# EAGLE design SensorHub (EAGLE 9.5.2)
CNAME: https://github.com/thomo/sensornode; CREVISION: v2.0; DESIGNER: ThoMo
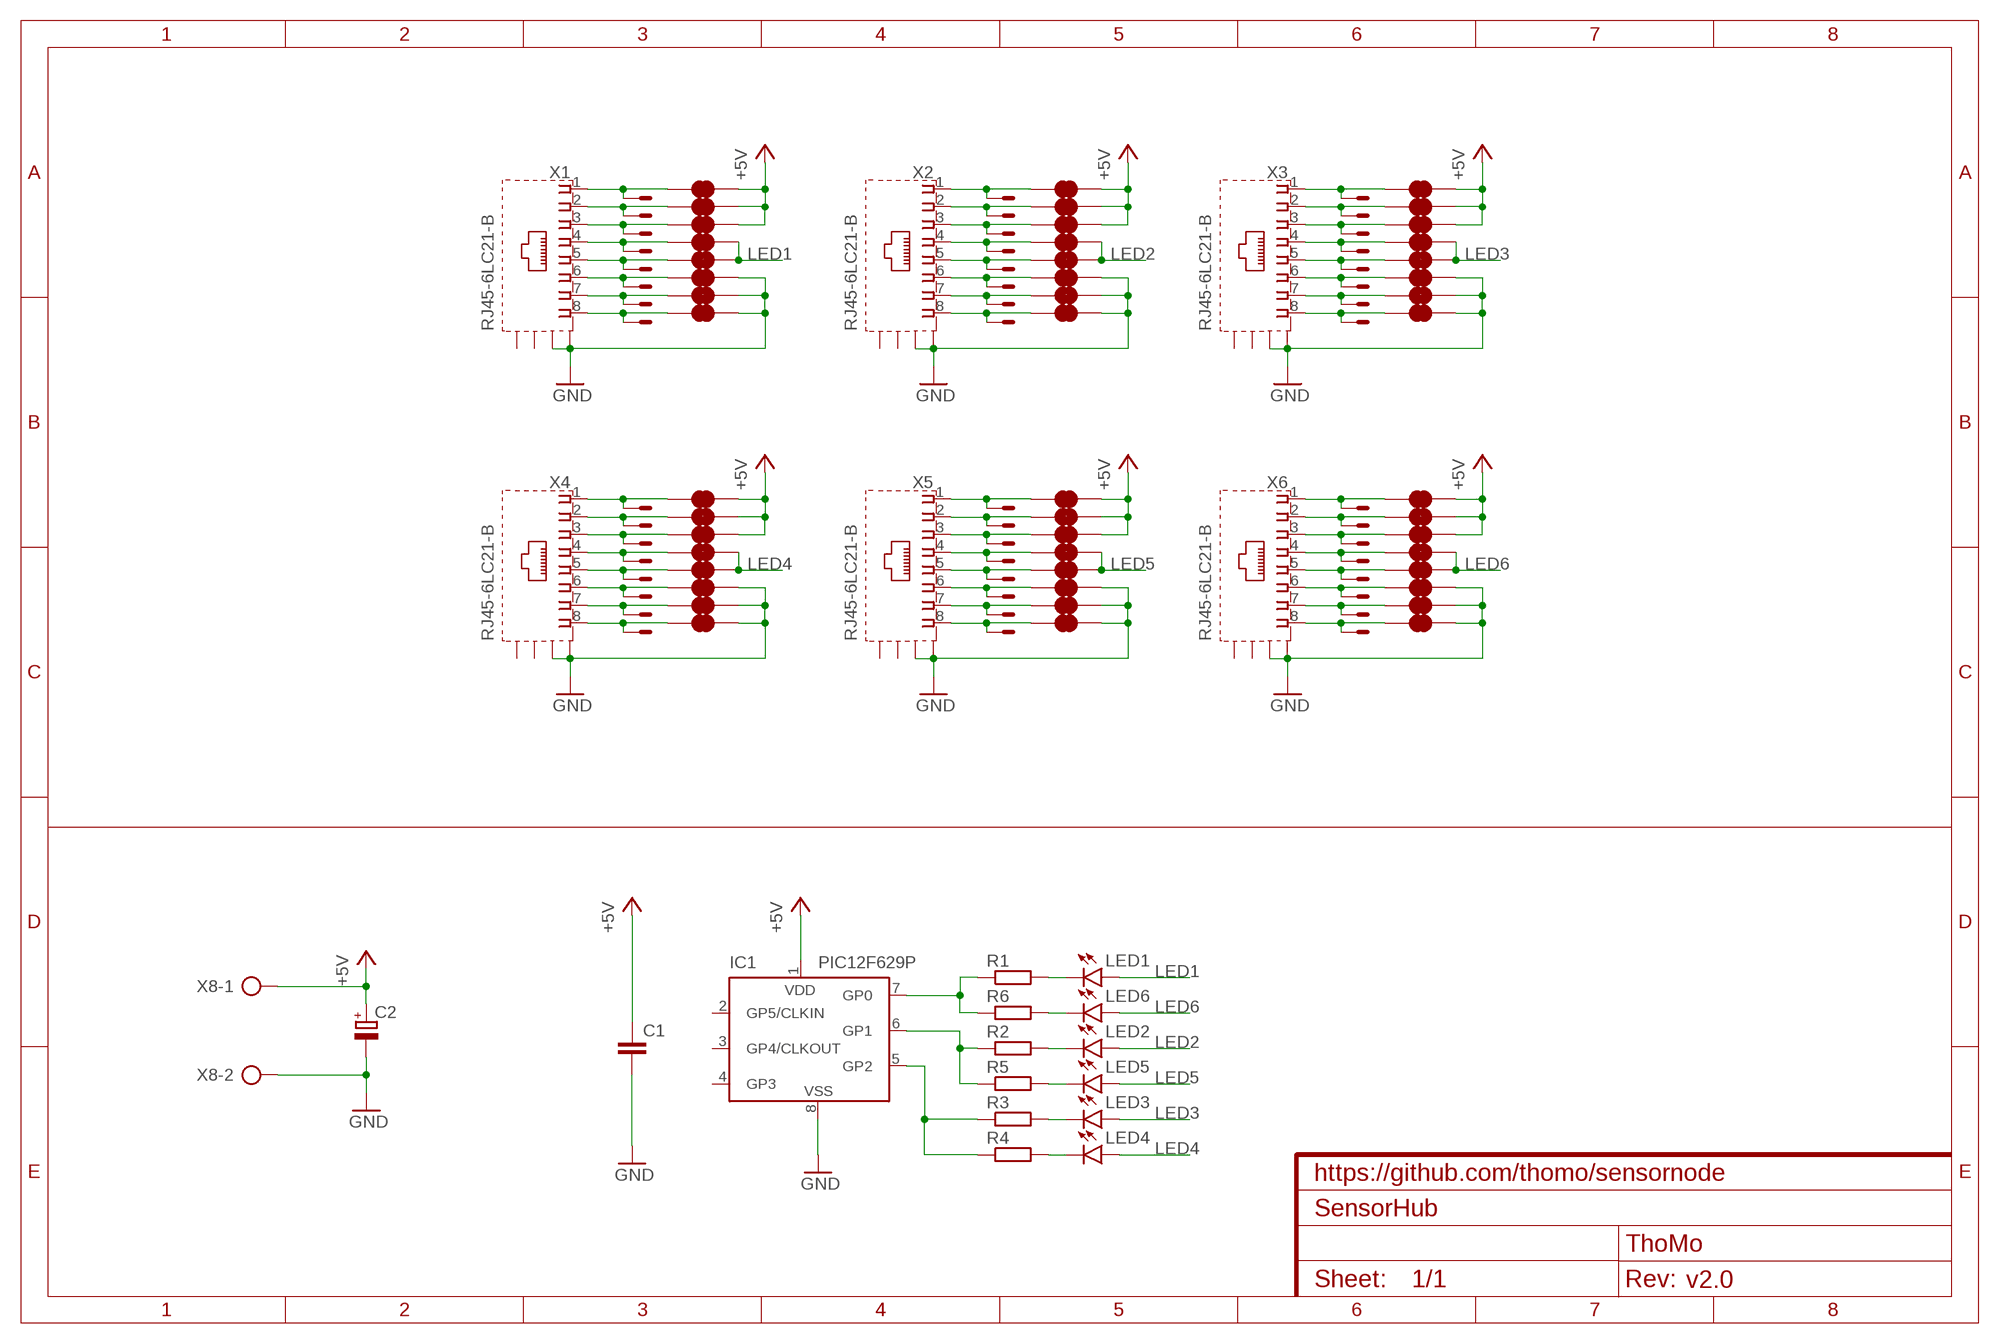
[diagram p0: schematic, sheet 1]

## Parts
C1  C-EU050-024X044  [C050-024X044]
C2  CPOL-EUE3.5-8  [E3,5-8]
IC1  PIC12F629P  [DIL8]
JP1  JUMPER-SMT_2_NC_TRACE_SILK  [SMT-JUMPER_2_NC_TRACE_SILK]
JP2  JUMPER-SMT_2_NC_TRACE_SILK  [SMT-JUMPER_2_NC_TRACE_SILK]
JP3  JUMPER-SMT_2_NC_TRACE_SILK  [SMT-JUMPER_2_NC_TRACE_SILK]
JP4  JUMPER-SMT_2_NC_TRACE_SILK  [SMT-JUMPER_2_NC_TRACE_SILK]
JP5  JUMPER-SMT_2_NC_TRACE_SILK  [SMT-JUMPER_2_NC_TRACE_SILK]
JP6  JUMPER-SMT_2_NC_TRACE_SILK  [SMT-JUMPER_2_NC_TRACE_SILK]
JP7  JUMPER-SMT_2_NC_TRACE_SILK  [SMT-JUMPER_2_NC_TRACE_SILK]
JP8  JUMPER-SMT_2_NC_TRACE_SILK  [SMT-JUMPER_2_NC_TRACE_SILK]
JP9  JUMPER-SMT_2_NC_TRACE_SILK  [SMT-JUMPER_2_NC_TRACE_SILK]
JP10  JUMPER-SMT_2_NC_TRACE_SILK  [SMT-JUMPER_2_NC_TRACE_SILK]
JP11  JUMPER-SMT_2_NC_TRACE_SILK  [SMT-JUMPER_2_NC_TRACE_SILK]
JP12  JUMPER-SMT_2_NC_TRACE_SILK  [SMT-JUMPER_2_NC_TRACE_SILK]
JP13  JUMPER-SMT_2_NC_TRACE_SILK  [SMT-JUMPER_2_NC_TRACE_SILK]
JP14  JUMPER-SMT_2_NC_TRACE_SILK  [SMT-JUMPER_2_NC_TRACE_SILK]
JP15  JUMPER-SMT_2_NC_TRACE_SILK  [SMT-JUMPER_2_NC_TRACE_SILK]
JP16  JUMPER-SMT_2_NC_TRACE_SILK  [SMT-JUMPER_2_NC_TRACE_SILK]
JP17  JUMPER-SMT_2_NC_TRACE_SILK  [SMT-JUMPER_2_NC_TRACE_SILK]
JP18  JUMPER-SMT_2_NC_TRACE_SILK  [SMT-JUMPER_2_NC_TRACE_SILK]
JP19  JUMPER-SMT_2_NC_TRACE_SILK  [SMT-JUMPER_2_NC_TRACE_SILK]
JP20  JUMPER-SMT_2_NC_TRACE_SILK  [SMT-JUMPER_2_NC_TRACE_SILK]
JP21  JUMPER-SMT_2_NC_TRACE_SILK  [SMT-JUMPER_2_NC_TRACE_SILK]
JP22  JUMPER-SMT_2_NC_TRACE_SILK  [SMT-JUMPER_2_NC_TRACE_SILK]
JP23  JUMPER-SMT_2_NC_TRACE_SILK  [SMT-JUMPER_2_NC_TRACE_SILK]
JP24  JUMPER-SMT_2_NC_TRACE_SILK  [SMT-JUMPER_2_NC_TRACE_SILK]
JP25  JUMPER-SMT_2_NC_TRACE_SILK  [SMT-JUMPER_2_NC_TRACE_SILK]
JP26  JUMPER-SMT_2_NC_TRACE_SILK  [SMT-JUMPER_2_NC_TRACE_SILK]
JP27  JUMPER-SMT_2_NC_TRACE_SILK  [SMT-JUMPER_2_NC_TRACE_SILK]
JP28  JUMPER-SMT_2_NC_TRACE_SILK  [SMT-JUMPER_2_NC_TRACE_SILK]
JP29  JUMPER-SMT_2_NC_TRACE_SILK  [SMT-JUMPER_2_NC_TRACE_SILK]
JP30  JUMPER-SMT_2_NC_TRACE_SILK  [SMT-JUMPER_2_NC_TRACE_SILK]
JP31  JUMPER-SMT_2_NC_TRACE_SILK  [SMT-JUMPER_2_NC_TRACE_SILK]
JP32  JUMPER-SMT_2_NC_TRACE_SILK  [SMT-JUMPER_2_NC_TRACE_SILK]
JP33  JUMPER-SMT_2_NC_TRACE_SILK  [SMT-JUMPER_2_NC_TRACE_SILK]
JP34  JUMPER-SMT_2_NC_TRACE_SILK  [SMT-JUMPER_2_NC_TRACE_SILK]
JP35  JUMPER-SMT_2_NC_TRACE_SILK  [SMT-JUMPER_2_NC_TRACE_SILK]
JP36  JUMPER-SMT_2_NC_TRACE_SILK  [SMT-JUMPER_2_NC_TRACE_SILK]
JP37  JUMPER-SMT_2_NC_TRACE_SILK  [SMT-JUMPER_2_NC_TRACE_SILK]
JP38  JUMPER-SMT_2_NC_TRACE_SILK  [SMT-JUMPER_2_NC_TRACE_SILK]
JP39  JUMPER-SMT_2_NC_TRACE_SILK  [SMT-JUMPER_2_NC_TRACE_SILK]
JP40  JUMPER-SMT_2_NC_TRACE_SILK  [SMT-JUMPER_2_NC_TRACE_SILK]
JP41  JUMPER-SMT_2_NC_TRACE_SILK  [SMT-JUMPER_2_NC_TRACE_SILK]
JP42  JUMPER-SMT_2_NC_TRACE_SILK  [SMT-JUMPER_2_NC_TRACE_SILK]
JP43  JUMPER-SMT_2_NC_TRACE_SILK  [SMT-JUMPER_2_NC_TRACE_SILK]
JP44  JUMPER-SMT_2_NC_TRACE_SILK  [SMT-JUMPER_2_NC_TRACE_SILK]
JP45  JUMPER-SMT_2_NC_TRACE_SILK  [SMT-JUMPER_2_NC_TRACE_SILK]
JP46  JUMPER-SMT_2_NC_TRACE_SILK  [SMT-JUMPER_2_NC_TRACE_SILK]
JP47  JUMPER-SMT_2_NC_TRACE_SILK  [SMT-JUMPER_2_NC_TRACE_SILK]
JP48  JUMPER-SMT_2_NC_TRACE_SILK  [SMT-JUMPER_2_NC_TRACE_SILK]
LED1  TLLR4400  [LED3MM]
LED2  TLLR4400  [LED3MM]
LED3  TLLR4400  [LED3MM]
LED4  TLLR4400  [LED3MM]
LED5  TLLR4400  [LED3MM]
LED6  TLLR4400  [LED3MM]
R1  R-EU_0207/10  [0207/10]
R2  R-EU_0207/10  [0207/10]
R3  R-EU_0207/10  [0207/10]
R4  R-EU_0207/10  [0207/10]
R5  R-EU_0207/10  [0207/10]
R6  R-EU_0207/10  [0207/10]
X1  RJ45-6LC21-B  [RJ45-SHIELD1]
X1.1  22-23-2081  [22-23-2081]
X1.2  22-23-2081  [22-23-2081]
X1.3  22-23-2081  [22-23-2081]
X1.4  22-23-2081  [22-23-2081]
X1.5  22-23-2081  [22-23-2081]
X1.6  22-23-2081  [22-23-2081]
X2  RJ45-6LC21-B  [RJ45-SHIELD1]
X3  RJ45-6LC21-B  [RJ45-SHIELD1]
X4  RJ45-6LC21-B  [RJ45-SHIELD1]
X5  RJ45-6LC21-B  [RJ45-SHIELD1]
X6  RJ45-6LC21-B  [RJ45-SHIELD1]
X8  AK500/2  [AK500/2]

## Nets
+5V: C1.1 C2.+ IC1.1(VDD) JP1.2 JP2.2 JP3.2 JP9.2 JP10.2 JP11.2 JP17.2 JP18.2 JP19.2 JP25.2 JP26.2 JP27.2 JP33.2 JP34.2 JP35.2 JP41.2 JP42.2 JP43.2 X8.1
GND: C1.2 C2.- IC1.8(VSS) JP6.2 JP7.2 JP8.2 JP14.2 JP15.2 JP16.2 JP22.2 JP23.2 JP24.2 JP30.2 JP31.2 JP32.2 JP38.2 JP39.2 JP40.2 JP46.2 JP47.2 JP48.2 X1.S1(S) X1.S2(S) X2.S1(S) X2.S2(S) X3.S1(S) X3.S2(S) X4.S1(S) X4.S2(S) X5.S1(S) X5.S2(S) X6.S1(S) X6.S2(S) X8.2
LED1: JP4.2 JP5.2 LED1.A
LED2: JP12.2 JP13.2 LED2.A
LED3: JP20.2 JP21.2 LED3.A
LED4: JP28.2 JP29.2 LED4.A
LED5: JP36.2 JP37.2 LED5.A
LED6: JP44.2 JP45.2 LED6.A
N$1: JP1.1 X1.1 X1.1.1
N$2: JP2.1 X1.1.2 X1.2
N$3: JP3.1 X1.1.3 X1.3
N$4: JP4.1 X1.1.4 X1.4
N$5: JP5.1 X1.1.5 X1.5
N$6: JP6.1 X1.1.6 X1.6
N$7: JP7.1 X1.1.7 X1.7
N$8: JP8.1 X1.1.8 X1.8
N$9: JP9.1 X1.2.1 X2.1
N$10: IC1.6(GP1) R2.1 R5.1
N$11: LED1.K(C) R1.2
N$12: LED2.K(C) R2.2
N$13: LED3.K(C) R3.2
N$14: LED6.K(C) R6.2
N$15: LED5.K(C) R5.2
N$16: LED4.K(C) R4.2
N$17: JP10.1 X1.2.2 X2.2
N$18: JP11.1 X1.2.3 X2.3
N$19: JP12.1 X1.2.4 X2.4
N$20: IC1.7(GP0) R1.1 R6.1
N$21: JP13.1 X1.2.5 X2.5
N$22: IC1.5(GP2) R3.1 R4.1
N$23: JP14.1 X1.2.6 X2.6
N$24: JP15.1 X1.2.7 X2.7
N$25: JP16.1 X1.2.8 X2.8
N$26: JP17.1 X1.3.1 X3.1
N$27: JP18.1 X1.3.2 X3.2
N$28: JP19.1 X1.3.3 X3.3
N$29: JP20.1 X1.3.4 X3.4
N$30: JP21.1 X1.3.5 X3.5
N$31: JP22.1 X1.3.6 X3.6
N$32: JP23.1 X1.3.7 X3.7
N$33: JP24.1 X1.3.8 X3.8
N$34: JP25.1 X1.4.1 X4.1
N$35: JP26.1 X1.4.2 X4.2
N$36: JP27.1 X1.4.3 X4.3
N$37: JP28.1 X1.4.4 X4.4
N$38: JP29.1 X1.4.5 X4.5
N$39: JP30.1 X1.4.6 X4.6
N$40: JP31.1 X1.4.7 X4.7
N$41: JP32.1 X1.4.8 X4.8
N$42: JP33.1 X1.5.1 X5.1
N$43: JP34.1 X1.5.2 X5.2
N$44: JP35.1 X1.5.3 X5.3
N$45: JP36.1 X1.5.4 X5.4
N$46: JP37.1 X1.5.5 X5.5
N$47: JP38.1 X1.5.6 X5.6
N$48: JP39.1 X1.5.7 X5.7
N$49: JP40.1 X1.5.8 X5.8
N$50: JP41.1 X1.6.1 X6.1
N$51: JP42.1 X1.6.2 X6.2
N$52: JP43.1 X1.6.3 X6.3
N$53: JP44.1 X1.6.4 X6.4
N$54: JP45.1 X1.6.5 X6.5
N$55: JP46.1 X1.6.6 X6.6
N$56: JP47.1 X1.6.7 X6.7
N$57: JP48.1 X1.6.8 X6.8
Unconnected: IC1.2(GP5/CLKIN) IC1.3(GP4/CLKOUT) IC1.4(GP3) X1.S3(S) X1.S4(S) X2.S3(S) X2.S4(S) X3.S3(S) X3.S4(S) X4.S3(S) X4.S4(S) X5.S3(S) X5.S4(S) X6.S3(S) X6.S4(S)

## Library data of the parts
C1 = rcl:C-EU: CAPACITOR, European symbol; SPICEPREFIX: C
C2 = rcl:CPOL-EU: POLARIZED CAPACITOR, European symbol; SPICEPREFIX: C
IC1 = microchip:PIC12F6*: Data Sheet 8-Pin FLASH-Based 8-Bit CMOS Microcontrollers Source: http://www.microchip.com .. 41190c.pdf; MF: MICROCHIP; MPN: PIC12F629-I/P; OC_FARNELL: 1292253; OC_NEWARK: 67K0822
JP1-JP48 = SparkFun-Jumpers:JUMPER-SMT_2_NC_TRACE: Normally closed trace jumper This jumper has a trace between two pads so it's normally closed (NC). Use a razor knife to open the connection. For best results follow the IPC guidelines for cutting traces: Cutout at least 0.063 mm (0.005 in). Remove all loose material to clean up the cut area. Seal the cut with an approved epoxy. Reapply solder to reclose the connection.
LED1-LED6 = led:TLLR4400: Low Current (2mA) LED 3 mm Tinted Diffused Package color RED Source: Data sheet <http://www.farnell.com/datasheets/391100.pdf>; MF: VISHAY SEMICONDUCTOR; OC_FARNELL: 1612437
R1-R6 = rcl:R-EU_: RESISTOR, European symbol; SPICEPREFIX: R
X1-X6 = con-tycoelectronics:RJ45*2: RJ45 Low Profile Shield Type 2 For all RJ45 L, LC, LCT and X Series Models Source: www.tycoelectronics.com .. ENG_DS_1654001_1099_RJ_L_0507.pdf; OC_FARNELL: unknown; OC_NEWARK: unknown
X1.1-X1.6 = con-molex:22-23-2081: .100" (2.54mm) Center Header - 8 Pin; MF: MOLEX; MPN: 22-23-2081; OC_FARNELL: 1756826; OC_NEWARK: 01C7592
X8 = con-ptr500:AK500/2: CONNECTOR; OC_FARNELL: unknown; OC_NEWARK: unknown

## Board
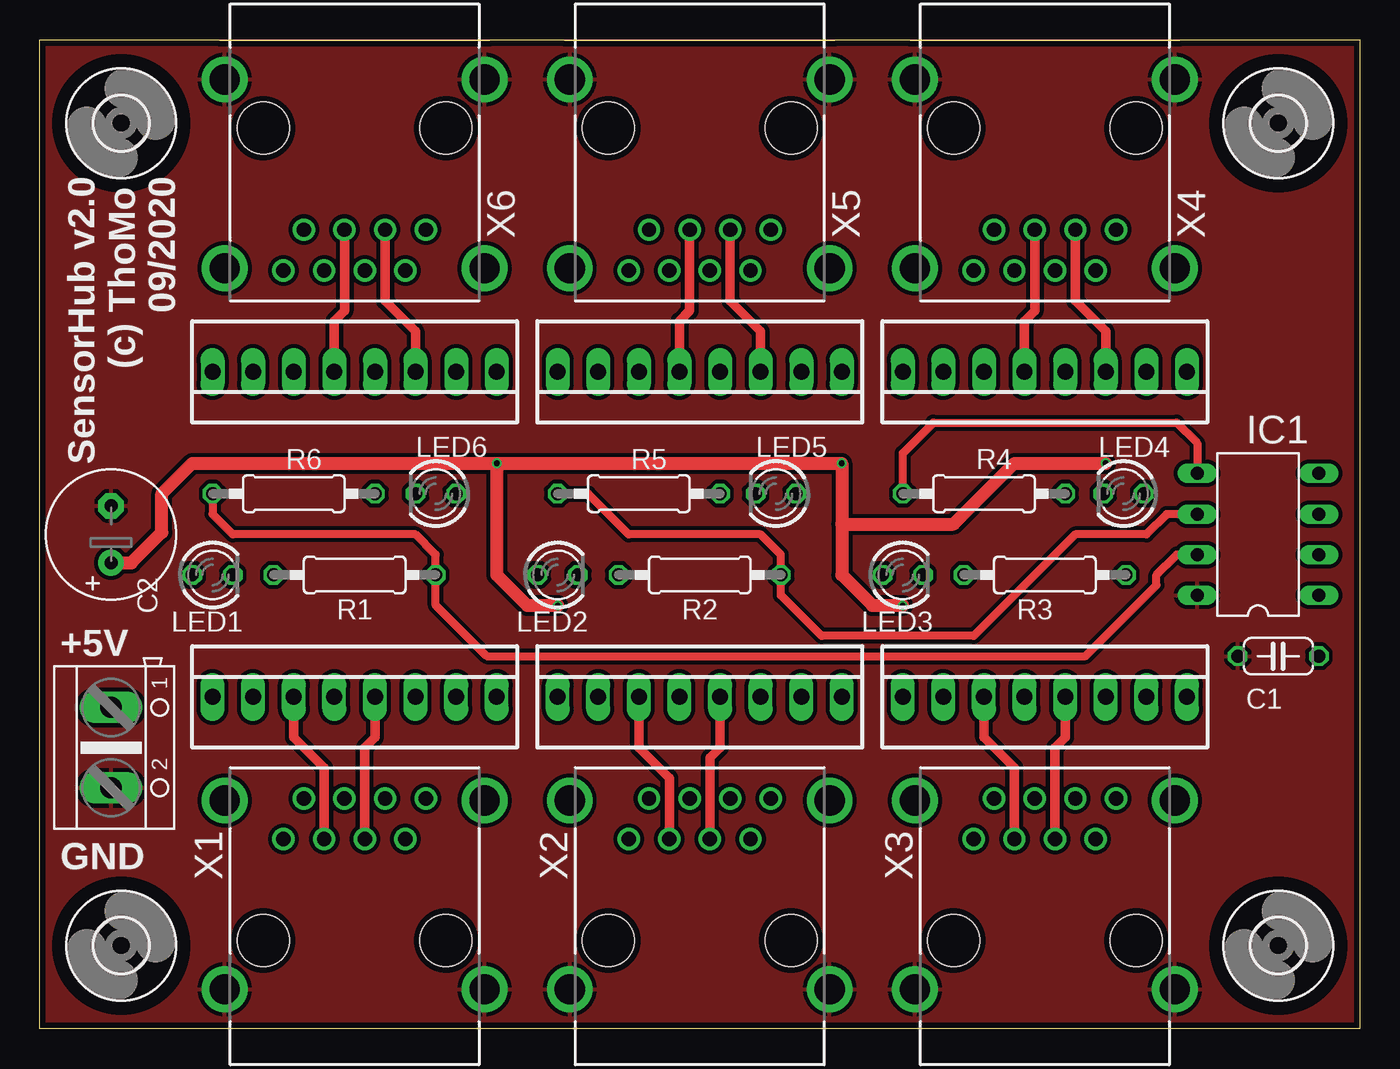
[diagram p1: board, top side]
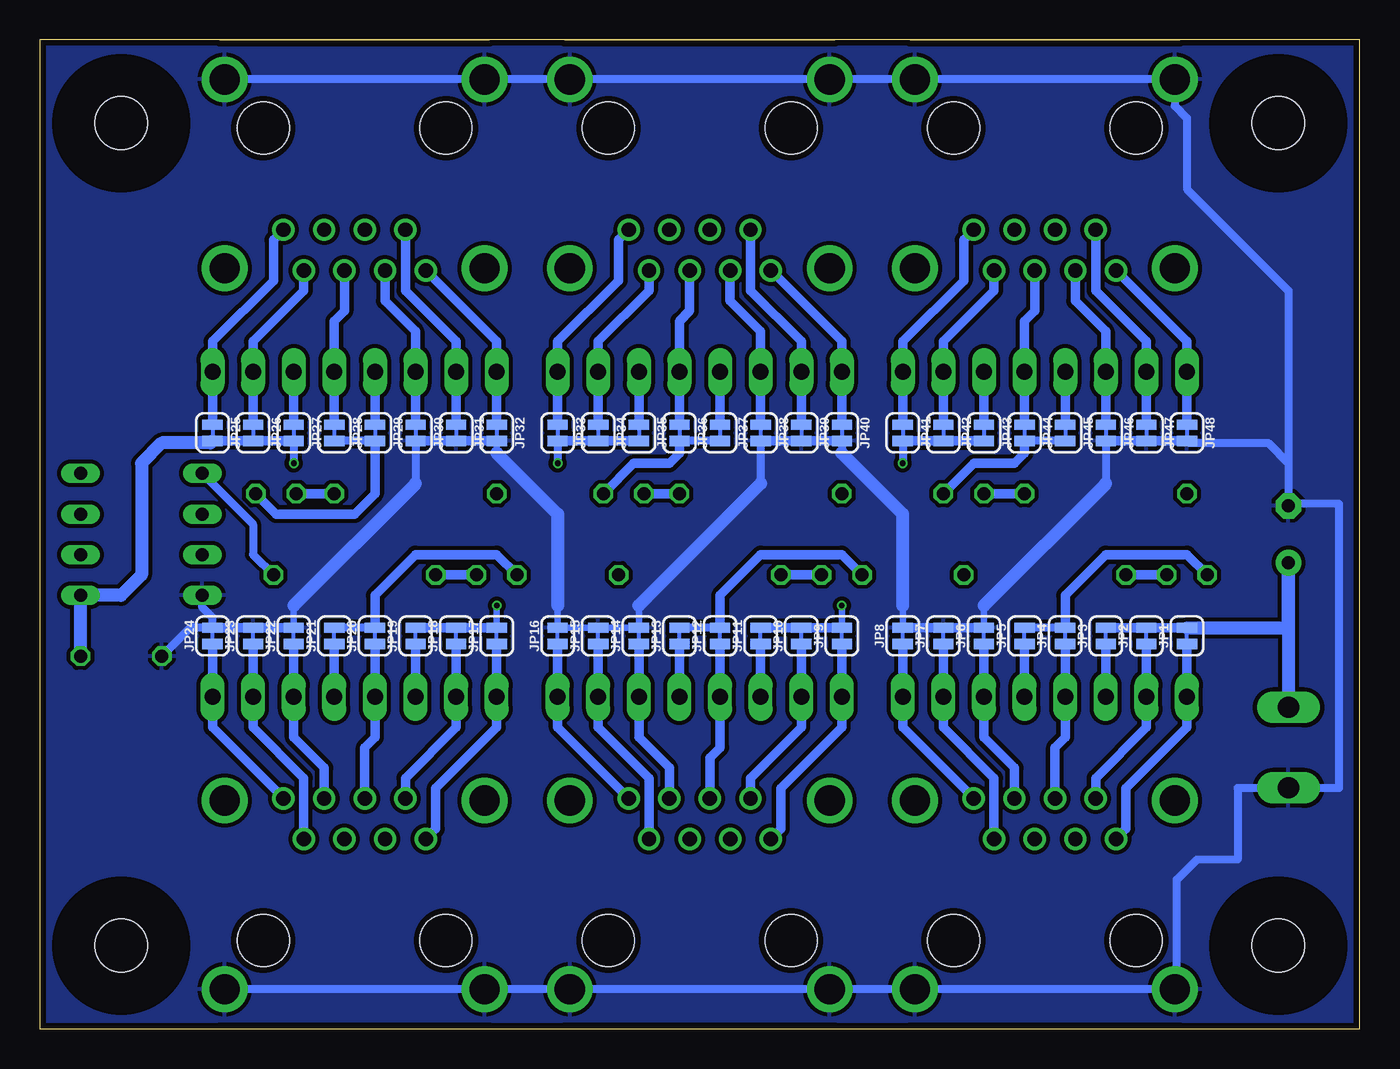
[diagram p2: board, bottom side, seen from below]

Size 82.55 x 61.83 mm. Coordinates in mm from the lower left corner, seen from the top.
Outline: 0,0 0,61.83 82.55,61.83 82.55,0 0,0
Copper layers (1*16): Top 0.035559375mm / dielectric 1.6mm / Bottom 0.035559375mm
Design rules "oshpark-2layer": minimum track width 6mil, minimum drill 10mil, track to track 6mil, track to pad 6mil, pad to pad 6mil, via to via 6mil, smd to smd 6mil, copper to edge 15mil, drill to drill 6mil, minimum pad ring 5mil, minimum via ring 5mil, stop-mask expansion 2.5mil, vias tented up to drill 0mil, thermal gap 10mil

### Footprints (pad centres in the part's own frame; a part is rotated, then mirrored left to right if it is on the bottom)
C050-024X044 = drill 0.813 octagon: 1 -2.54,0; 2 2.54,0
E3,5-8 = drill 0.813 pad 1.6: + -1.778,0 | drill 0.813 pad 1.6 octagon: - 1.778,0
DIL8 = drill 0.813 long: 1 -3.81,-3.81; 2 -1.27,-3.81; 3 1.27,-3.81; 4 3.81,-3.81; 5 3.81,3.81; 6 1.27,3.81; 7 -1.27,3.81; 8 -3.81,3.81
SMT-JUMPER_2_NC_TRACE_SILK = smd 0.635 x 1.27: 1 -0.508,0; 2 0.508,0
LED3MM = drill 0.813 octagon: A -1.27,0; K 1.27,0
0207/10 = drill 0.813 octagon: 1 -5.08,0; 2 5.08,0
3,3 = hole 3.3: 0,0
RJ45-SHIELD1 = drill 0.9 pad 1.4: 1 -4.445,6.35; 2 -3.175,8.89; 3 -1.905,6.35; 4 -0.635,8.89; 5 0.635,6.35; 6 1.905,8.89; 7 3.175,6.35; 8 4.445,8.89 | drill 1.9 pad 2.5: S1 -8.128,-3.048; S2 8.128,-3.048; S3 -8.128,8.76; S4 8.128,8.76 | hole 3.251: -5.715,0; 5.715,0
22-23-2081 = drill 1 long: 1 -8.89,0; 2 -6.35,0; 3 -3.81,0; 4 -1.27,0; 5 1.27,0; 6 3.81,0; 7 6.35,0; 8 8.89,0
AK500/2 = drill 1.321 long: 1 -2.515,0; 2 2.515,0

### Placement (x,y rotation side)
C1  77.47,23.3 180 top
C2  4.45,30.92 90 top
IC1  76.2,30.92 90 top
JP1  10.79,24.57 90 bottom
JP2  13.34,24.57 90 bottom
JP3  15.88,24.57 90 bottom
JP4  18.41,24.57 90 bottom
JP5  20.95,24.57 90 bottom
JP6  23.5,24.57 90 bottom
JP7  26.04,24.57 90 bottom
JP8  28.57,24.57 90 bottom
JP9  32.38,24.57 90 bottom
JP10  34.92,24.57 90 bottom
JP11  37.47,24.57 90 bottom
JP12  40.01,24.57 90 bottom
JP13  42.55,24.57 90 bottom
JP14  45.09,24.57 90 bottom
JP15  47.62,24.57 90 bottom
JP16  50.16,24.57 90 bottom
JP17  53.98,24.57 90 bottom
JP18  56.52,24.57 90 bottom
JP19  59.05,24.57 90 bottom
JP20  61.59,24.57 90 bottom
JP21  64.14,24.57 90 bottom
JP22  66.67,24.57 90 bottom
JP23  69.22,24.57 90 bottom
JP24  71.75,24.57 90 bottom
JP25  71.75,37.27 270 bottom
JP26  69.22,37.27 270 bottom
JP27  66.67,37.27 270 bottom
JP28  64.14,37.27 270 bottom
JP29  61.59,37.27 270 bottom
JP30  59.05,37.27 270 bottom
JP31  56.52,37.27 270 bottom
JP32  53.98,37.27 270 bottom
JP33  50.16,37.27 270 bottom
JP34  47.62,37.27 270 bottom
JP35  45.09,37.27 270 bottom
JP36  42.55,37.27 270 bottom
JP37  40.01,37.27 270 bottom
JP38  37.47,37.27 270 bottom
JP39  34.92,37.27 270 bottom
JP40  32.38,37.27 270 bottom
JP41  28.57,37.27 270 bottom
JP42  26.04,37.27 270 bottom
JP43  23.5,37.27 270 bottom
JP44  20.95,37.27 270 bottom
JP45  18.41,37.27 270 bottom
JP46  15.88,37.27 270 bottom
JP47  13.34,37.27 270 bottom
JP48  10.79,37.27 270 bottom
LED1  10.79,28.38 0 top
LED2  32.38,28.38 0 top
LED3  53.98,28.38 0 top
LED4  67.79,33.46 180 top
LED5  46.04,33.46 180 top
LED6  24.77,33.46 180 top
R1  19.68,28.38 180 top
R2  41.27,28.38 180 top
R3  62.87,28.38 180 top
R4  59.05,33.46 0 top
R5  37.47,33.46 0 top
R6  15.88,33.46 0 top
U$1  [3,3]  5.08,5.2 0 top
U$2  [3,3]  5.08,56.63 0 top
U$3  [3,3]  77.47,56.63 0 top
U$4  [3,3]  77.47,5.2 0 top
X1  19.68,5.52 0 top
X1.1  19.68,20.76 0 top
X1.2  41.27,20.76 0 top
X1.3  62.87,20.76 0 top
X1.4  62.87,41.08 180 top
X1.5  41.27,41.08 180 top
X1.6  19.68,41.08 180 top
X2  41.27,5.52 0 top
X3  62.87,5.52 0 top
X4  62.87,56.32 180 top
X5  41.27,56.32 180 top
X6  19.68,56.32 180 top
X8  4.45,17.58 270 top

### Tracks (layer width: path | path; a pad name or v marks a point on that pad's centre or on a via)
+5V  (via drill 0.35)
  Top 0.813: v28.57,35.36 28.57,28.38 30.48,26.47 v32.38,26.47 | 50.16,31.55 v50.16,35.36 v28.57,35.36 | 50.16,31.55 50.16,28.38 52.07,26.47 v53.98,26.47 | C2.+ 5.71,29.14 7.62,31.04 7.62,33.46 9.53,35.36 v28.57,35.36 | 50.16,31.55 57.15,31.55 60.96,35.36 v66.67,35.36
  Bottom 0.406: JP9.2 v32.38,26.47 | JP17.2 v53.98,26.47
  Bottom 0.508: JP41.2 v28.57,35.36 | JP33.2 v50.16,35.36 | JP27.2 v66.67,35.36
  Bottom 0.61: JP19.2 JP18.2 JP17.2 | JP11.2 JP10.2 JP9.2 | JP3.2 JP2.2 JP1.2 | JP27.2 JP26.2 JP25.2 | JP35.2 JP34.2 JP33.2 | JP41.2 JP42.2 JP43.2
  Bottom 0.813: X8.1 C2.+ 4.45,25.07 JP1.2 | C1.1 IC1.1 77.47,27.11 76.2,28.38 76.2,35.36 74.93,36.63 71.88,36.63 JP25.2
GND
  Bottom 0.406: 66.67,26.47 JP22.2 | JP32.2 53.98,36 | 50.16,26.47 JP16.2 JP15.2 JP14.2 45.09,26.47 | JP8.2 28.57,26.47 | JP6.2 23.5,26.47
  Bottom 0.508: JP30.2 59.05,34.09 | JP38.2 37.47,34.09 | JP40.2 32.38,36 | JP46.2 15.88,34.09 | IC1.8 72.39,26.34 71.75,25.71 JP24.2 73.15,25.07 C1.2 | JP48.2 10.67,36.63 5.71,36.63 4.45,35.36 | 4.45,35.36 4.45,32.82 | 4.45,32.82 C2.- | 4.45,32.82 1.27,32.82 1.27,15.07 X8.2 4.47,15.04 7.62,15.04 7.62,10.6 10.16,10.6 11.43,9.33 11.43,2.6 X1.S1 X1.S2 X2.S1 X2.S2 X3.S1 X3.S2 | X4.S1 X4.S2 X5.S1 X5.S2 X6.S1 X6.S2 11.56,57.71 10.79,56.95 10.79,52.51 4.45,46.16 4.45,35.36
  Bottom 0.61: JP22.2 JP23.2 JP24.2 | JP6.2 JP7.2 JP8.2 | JP32.2 JP31.2 JP30.2 | JP40.2 JP39.2 JP38.2 | JP46.2 JP47.2 JP48.2
  Bottom 0.813: 59.05,34.09 66.67,26.47 | 53.98,36 50.16,32.19 50.16,26.47 | 37.47,34.09 45.09,26.47 | 32.38,36 28.57,32.19 28.57,26.47 | 15.88,34.09 23.5,26.47
  pour Bottom (isolate 0.254): 0,61.71 0,0.12 82.55,0.12 82.55,61.71
  pour Top (isolate 0.254): 0,61.71 0,0.12 82.55,0.12 82.55,61.71
LED1
  Bottom 0.508: JP4.2 JP5.2
  Bottom 0.61: JP4.2 18.41,27.11 15.88,29.65 10.79,29.65 LED1.A
LED2
  Bottom 0.508: JP12.2 JP13.2
  Bottom 0.61: JP12.2 40.01,27.11 37.47,29.65 32.38,29.65 LED2.A
LED3
  Bottom 0.508: JP20.2 JP21.2
  Bottom 0.61: JP20.2 61.59,27.11 59.05,29.65 53.98,29.65 LED3.A
LED4
  Bottom 0.508: JP29.2 JP28.2
  Bottom 0.61: JP29.2 61.59,33.46 62.87,32.19 67.79,32.19 LED4.A
LED5
  Bottom 0.508: JP37.2 JP36.2
  Bottom 0.61: LED5.A 45.4,35.36 43.18,35.36 42.55,36 JP36.2
LED6
  Bottom 0.508: JP45.2 JP44.2
  Bottom 0.61: JP44.2 20.95,36 21.59,35.36 24.13,35.36 LED6.A
N$1
  Bottom 0.61: X1.1 14.61,12.5 14.61,15.04 10.79,18.85 X1.1.1 JP1.1
N$2
  Bottom 0.61: X1.2 16.51,15.68 13.34,18.85 X1.1.2 JP2.1
N$3
  Top 0.61: X1.1.3 15.88,18.22 17.78,16.31 X1.3
  Bottom 0.61: JP3.1 X1.1.3
N$4
  Bottom 0.61: X1.4 19.05,17.58 18.41,18.22 X1.1.4 JP4.1
N$5
  Top 0.61: X1.1.5 20.95,18.22 20.32,17.58 X1.5
  Bottom 0.61: JP5.1 X1.1.5
N$6
  Bottom 0.61: X1.6 21.59,16.31 23.5,18.22 X1.1.6 JP6.1
N$7
  Bottom 0.61: X1.7 22.86,15.68 26.04,18.85 X1.1.7 JP7.1
N$8
  Bottom 0.61: X1.8 28.57,18.85 X1.1.8 JP8.1
N$9
  Bottom 0.61: X2.1 36.2,12.5 36.2,15.04 32.38,18.85 X1.2.1 JP9.1
N$10
  Top 0.508: R5.1 34.29,33.46 36.83,30.92 45.09,30.92 46.35,29.65 R2.1 46.35,27.11 48.9,24.57 58.42,24.57 64.77,30.92 69.22,30.92 70.48,32.19 IC1.6
N$11
  Bottom 0.61: LED1.K R1.2
N$12
  Bottom 0.61: LED2.K R2.2
N$13
  Bottom 0.61: LED3.K R3.2
N$14
  Bottom 0.61: R6.2 LED6.K
N$15
  Bottom 0.61: R5.2 LED5.K
N$16
  Bottom 0.61: R4.2 LED4.K
N$17
  Bottom 0.61: X2.2 38.1,15.68 34.92,18.85 X1.2.2 JP10.1
N$18
  Top 0.61: X2.3 39.37,15.68 37.47,17.58 X1.2.3
  Bottom 0.61: JP11.1 X1.2.3
N$19
  Bottom 0.61: X2.4 40.64,16.95 40.01,17.58 X1.2.4 JP12.1
N$20
  Top 0.508: R6.1 10.79,32.19 12.06,30.92 23.5,30.92 24.77,29.65 R1.1 24.77,26.47 27.94,23.3 65.41,23.3 69.85,27.74 69.85,28.38 71.12,29.65 IC1.7
N$21
  Top 0.61: X2.5 41.91,16.95 42.55,17.58 X1.2.5
  Bottom 0.61: JP13.1 X1.2.5
N$22
  Top 0.508: IC1.5 72.39,36.63 71.12,37.9 55.88,37.9 53.98,36 R4.1
  Bottom 0.508: IC1.5 69.22,31.55 69.22,29.65 R3.1
N$23
  Bottom 0.61: X2.6 43.18,16.31 45.09,18.22 X1.2.6 JP14.1
N$24
  Bottom 0.61: X2.7 44.45,15.68 47.62,18.85 X1.2.7 JP15.1
N$25
  Bottom 0.61: X2.8 50.16,18.85 X1.2.8 JP16.1
N$26
  Bottom 0.61: X3.1 57.78,12.5 57.78,15.04 53.98,18.85 X1.3.1 JP17.1
N$27
  Bottom 0.61: X3.2 59.69,15.68 56.52,18.85 X1.3.2 JP18.1
N$28
  Top 0.61: X3.3 60.96,16.31 59.05,18.22 X1.3.3
  Bottom 0.61: JP19.1 X1.3.3
N$29
  Bottom 0.61: X3.4 62.23,17.58 61.59,18.22 X1.3.4 JP20.1
N$30
  Top 0.61: X3.5 63.5,17.58 64.14,18.22 X1.3.5
  Bottom 0.61: JP21.1 X1.3.5
N$31
  Bottom 0.61: X3.6 64.77,16.31 66.67,18.22 X1.3.6 JP22.1
N$32
  Bottom 0.61: X3.7 66.04,15.68 69.22,18.85 X1.3.7 JP23.1
N$33
  Bottom 0.61: X3.8 71.75,18.85 X1.3.8 JP24.1
N$34
  Bottom 0.61: X4.1 67.94,49.33 67.94,46.79 71.75,42.98 X1.4.1 JP25.1
N$35
  Bottom 0.61: X4.2 66.04,46.16 69.22,42.98 X1.4.2 JP26.1
N$36
  Top 0.61: X4.3 64.77,45.52 66.67,43.62 X1.4.3
  Bottom 0.61: JP27.1 X1.4.3
N$37
  Bottom 0.61: X4.4 63.5,44.89 64.14,44.25 X1.4.4 JP28.1
N$38
  Top 0.61: X4.5 62.23,44.89 61.59,44.25 X1.4.5
  Bottom 0.61: JP29.1 X1.4.5
N$39
  Bottom 0.61: X4.6 60.96,45.52 59.05,43.62 X1.4.6 JP30.1
N$40
  Bottom 0.61: X4.7 59.69,46.16 56.52,42.98 X1.4.7 JP31.1
N$41
  Bottom 0.61: X4.8 53.98,42.98 X1.4.8 JP32.1
N$42
  Bottom 0.61: X5.1 46.35,49.33 46.35,46.79 50.16,42.98 X1.5.1 JP33.1
N$43
  Bottom 0.61: X5.2 44.45,46.16 47.62,42.98 X1.5.2 JP34.1
N$44
  Top 0.61: X1.5.3 45.09,43.62 43.18,45.52 X5.3
  Bottom 0.61: JP35.1 X1.5.3
N$45
  Bottom 0.61: X5.4 41.91,44.89 42.55,44.25 X1.5.4 JP36.1
N$46
  Top 0.61: X5.5 40.64,44.89 40.01,44.25 X1.5.5
  Bottom 0.61: JP37.1 X1.5.5
N$47
  Bottom 0.61: X5.6 39.37,45.52 37.47,43.62 X1.5.6 JP38.1
N$48
  Bottom 0.61: X5.7 38.1,46.16 34.92,42.98 X1.5.7 JP39.1
N$49
  Bottom 0.61: X5.8 32.38,42.98 X1.5.8 JP40.1
N$50
  Bottom 0.61: X6.1 24.77,49.33 24.77,46.79 28.57,42.98 X1.6.1 JP41.1
N$51
  Bottom 0.61: X6.2 22.86,46.16 26.04,42.98 X1.6.2 JP42.1
N$52
  Top 0.61: X6.3 21.59,45.52 23.5,43.62 X1.6.3
  Bottom 0.61: JP43.1 X1.6.3
N$53
  Bottom 0.61: X6.4 20.32,44.89 20.95,44.25 X1.6.4 JP44.1
N$54
  Top 0.61: X1.6.5 18.41,44.25 19.05,44.89 X6.5
  Bottom 0.61: JP45.1 X1.6.5
N$55
  Bottom 0.61: X6.6 17.78,45.52 15.88,43.62 X1.6.6 JP46.1
N$56
  Bottom 0.61: X6.7 16.51,46.16 13.34,42.98 X1.6.7 JP47.1
N$57
  Bottom 0.61: X6.8 10.79,42.98 X1.6.8 JP48.1

### Text on the board
tPlace: SensorHub v2.0 / (c) ThoMo / 09/2020 | +5V | GND